# Altium schematic sheet STM32F4xx_Schematic.SchDoc
size A3; SheetNumber: 1; SheetTotal: 1
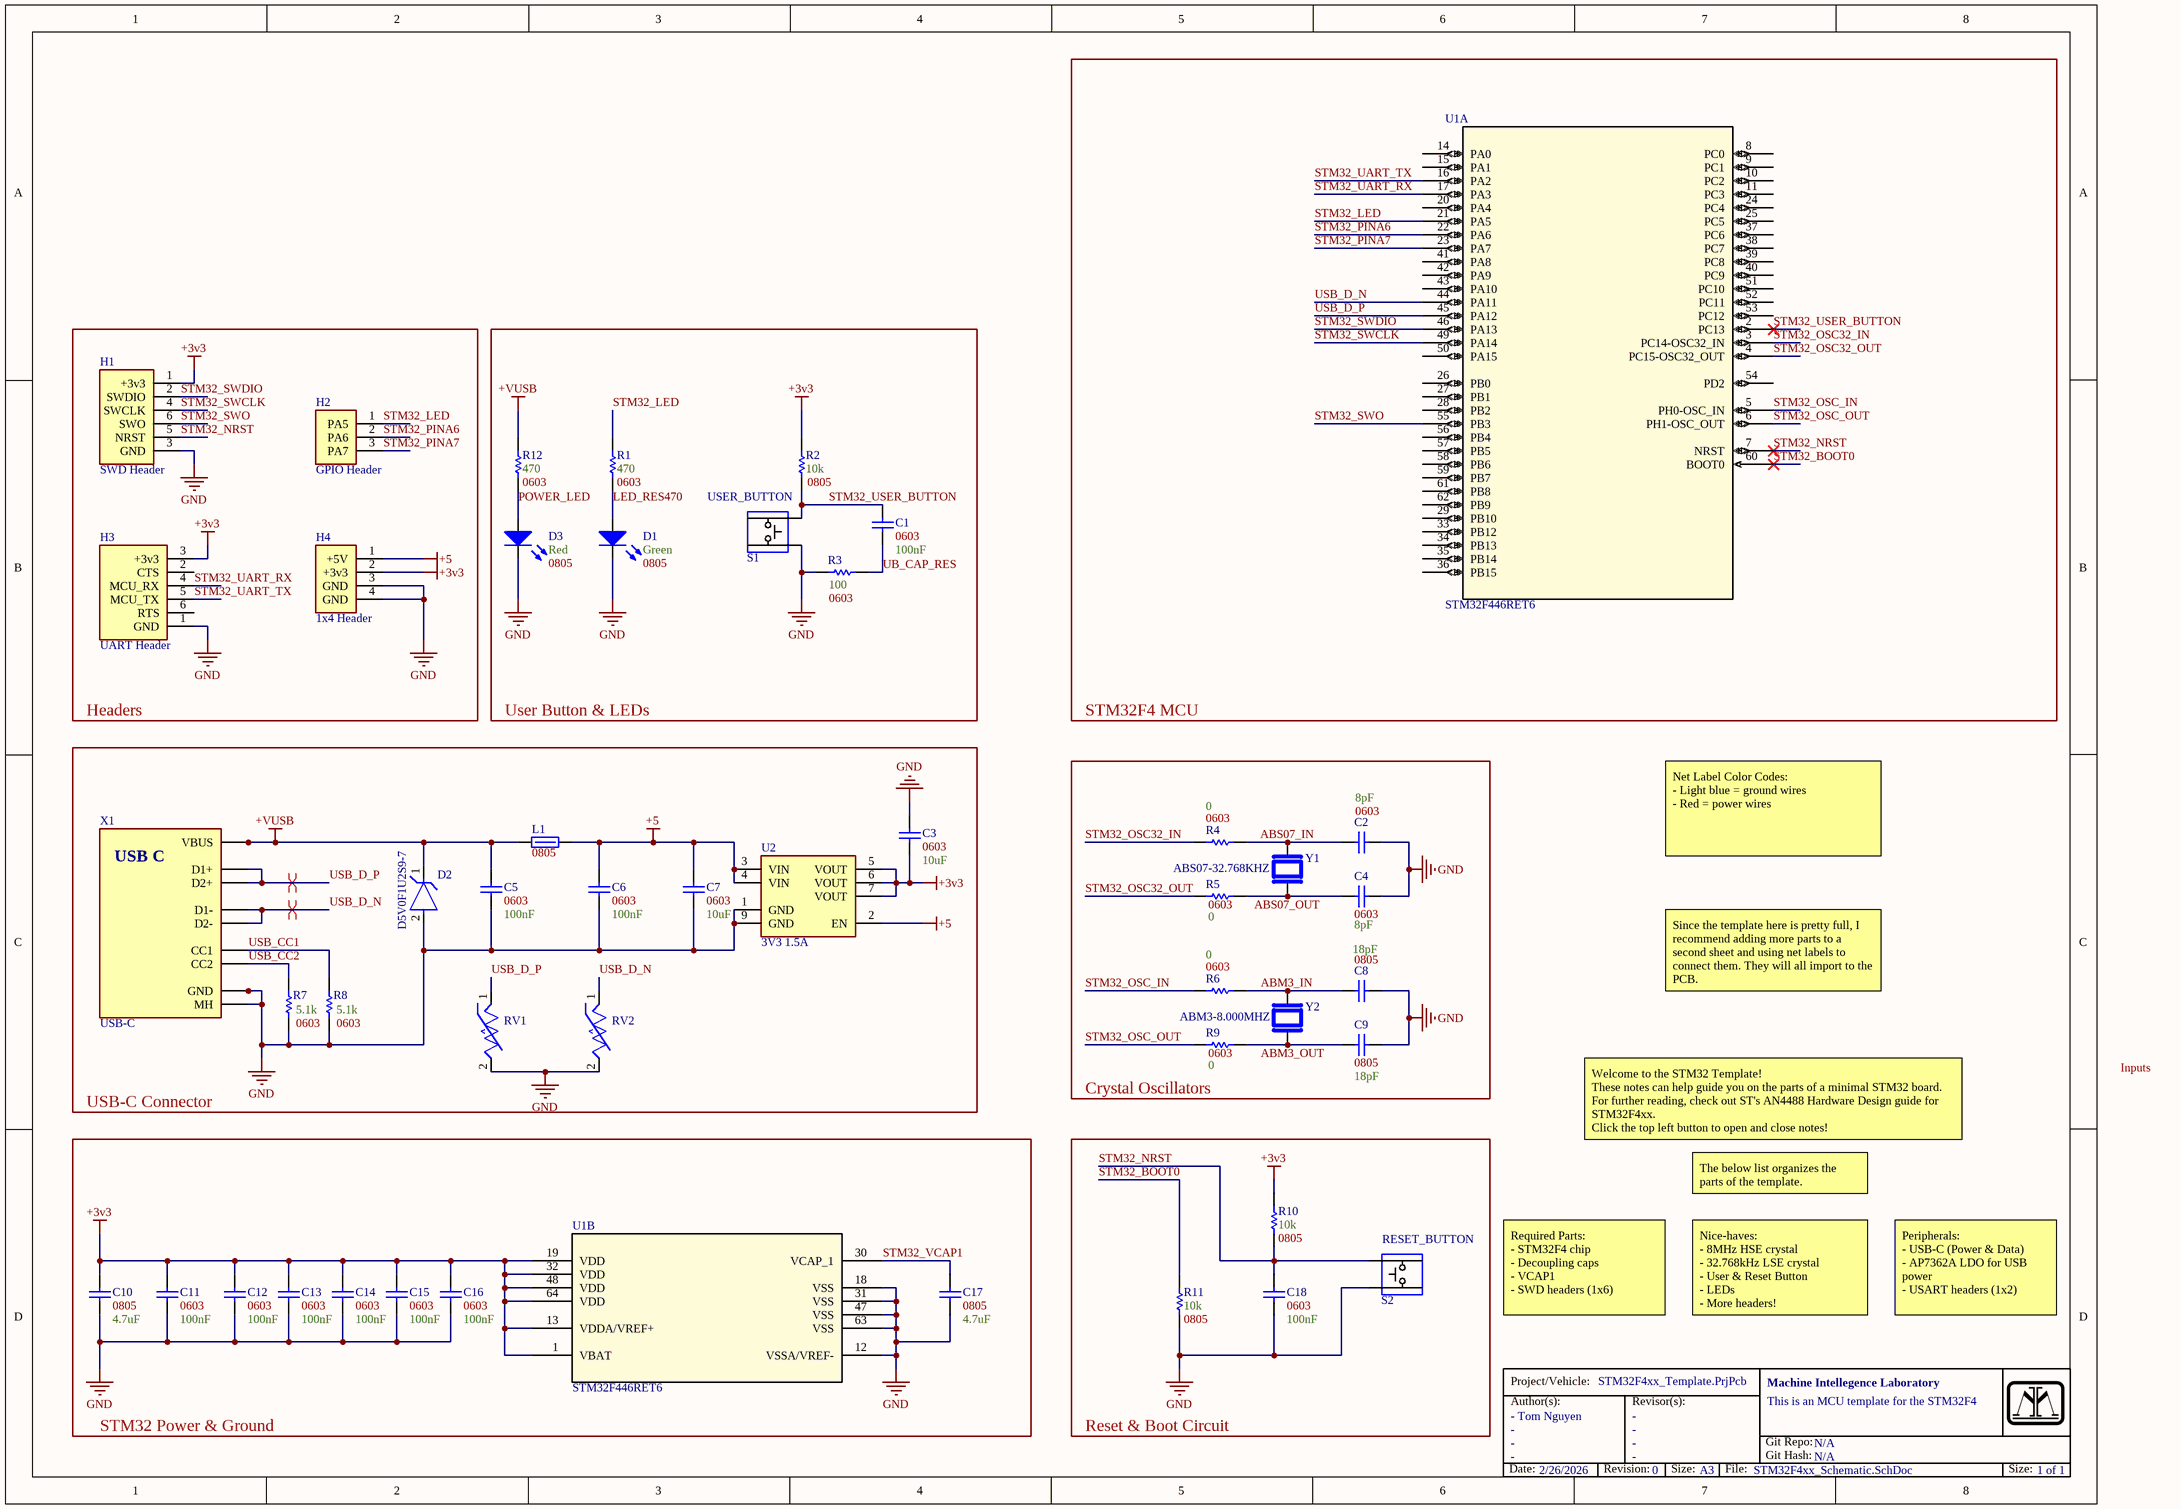
[diagram p0: STM32F4xx_Schematic.SchDoc]

## Parts
C1  Size Package: 0603  Capacitance: 100nF  [[Cap] SMD 0603]  (hidden comment: [Cap] 0603 0.1uF 10% 16V)
C2  Siz: 0603  [[Cap] 0603 8pF ±0.1pF 50V]  (hidden comment: 8pF)
C3  Size Package: 0603  Capacitance: 10uF  [[Cap] SMD 0603]  (hidden comment: [Cap] 0603 10uF 10% 10V)
C4  Siz: 0603  [[Cap] 0603 8pF ±0.1pF 50V]  (hidden comment: 8pF)
C5  Size Package: 0603  Capacitance: 100nF  [[Cap] SMD 0603]  (hidden comment: [Cap] 0603 0.1uF 10% 16V)
C6  Size Package: 0603  Capacitance: 100nF  [[Cap] SMD 0603]  (hidden comment: [Cap] 0603 0.1uF 10% 16V)
C7  Size Package: 0603  Capacitance: 10uF  [[Cap] SMD 0603]  (hidden comment: [Cap] 0603 10uF 10% 10V)
C8  Size: 0805  Capacitance: 18pF  [[Cap] 0805 ±5% 250V]  (hidden comment: [Cap] 0805 18pF ±5% 250V)
C9  Size: 0805  Capacitance: 18pF  [[Cap] 0805 ±5% 250V]  (hidden comment: [Cap] 0805 18pF ±5% 250V)
C10  Size Package: 0805  Capacitance: 4.7uF  [[Cap] SMD 0805]  (hidden comment: [Cap] 0805 4.7uF 10% 50V)
C11  Size Package: 0603  Capacitance: 100nF  [[Cap] SMD 0603]  (hidden comment: [Cap] 0603 0.1uF 10% 16V)
C12  Size Package: 0603  Capacitance: 100nF  [[Cap] SMD 0603]  (hidden comment: [Cap] 0603 0.1uF 10% 16V)
C13  Size Package: 0603  Capacitance: 100nF  [[Cap] SMD 0603]  (hidden comment: [Cap] 0603 0.1uF 10% 16V)
C14  Size Package: 0603  Capacitance: 100nF  [[Cap] SMD 0603]  (hidden comment: [Cap] 0603 0.1uF 10% 16V)
C15  Size Package: 0603  Capacitance: 100nF  [[Cap] SMD 0603]  (hidden comment: [Cap] 0603 0.1uF 10% 16V)
C16  Size Package: 0603  Capacitance: 100nF  [[Cap] SMD 0603]  (hidden comment: [Cap] 0603 0.1uF 10% 16V)
C17  Size Package: 0805  Capacitance: 4.7uF  [[Cap] SMD 0805]  (hidden comment: [Cap] 0805 4.7uF 10% 50V)
C18  Size Package: 0603  Capacitance: 100nF  [[Cap] SMD 0603]  (hidden comment: [Cap] 0603 0.1uF 10% 16V)
D1  Color: Green  Size Package: 0805  [[LED] SMD 0805]  (hidden comment: [LED] SMD 0805 Green)
D2  Cathode side marked by line  [[TVS] Unidirectional for 5V ESD]  (value not drawn)
D3  Color: Red  Size Package: 0805  [[LED] SMD 0805]  (hidden comment: [LED] SMD 0805 Red)
H1  SWD Header  [[Header] 1x6 Male STM32 SWD]
H2  GPIO Header  [[Header] 1x3 Male GPIO]
H3  UART Header  [[Header] 1x6 Male STM32 UART]
H4  1x4 Header  [[Header] 1x4 Male Power]
L1  Size Package: 0805  [[Ferrite] SMD 0805]  (hidden comment: 652-MH2029-300Y)
R1  Resistance: 470  Size Package: 0603  [RESC1608X55X25LL10T15]  (hidden comment: RC0603JR-13470RL)
R2  Resistance: 10k  Size Package: 0805  [[Res] SMD 0603]  (hidden comment: [10k] SMD 0603 1% 1/8W)
R3  Resistance: 100  Size Package: 0603  [[Res] SMD 0603]  (hidden comment: [100] SMD 0603 1% 1/10W)
R4  Resistance: 0  Size Package: 0603  [[0] SMD 0603 5% 1/10W]  (hidden comment: [0] SMD 0603 5% 1/10W)
R5  Resistance: 0  Size Package: 0603  [[0] SMD 0603 5% 1/10W]  (hidden comment: [0] SMD 0603 5% 1/10W)
R6  Resistance: 0  Size Package: 0603  [[0] SMD 0603 5% 1/10W]  (hidden comment: [0] SMD 0603 5% 1/10W)
R7  Resistance: 5.1k  Size Package: 0603  [[Res] SMD 0603]  (hidden comment: [5.1k] SMD 0603 1% 1/10W)
R8  Resistance: 5.1k  Size Package: 0603  [[Res] SMD 0603]  (hidden comment: [5.1k] SMD 0603 1% 1/10W)
R9  Resistance: 0  Size Package: 0603  [[0] SMD 0603 5% 1/10W]  (hidden comment: [0] SMD 0603 5% 1/10W)
R10  Resistance: 10k  Size Package: 0805  [[Res] SMD 0603]  (hidden comment: [10k] SMD 0603 1% 1/8W)
R11  Resistance: 10k  Size Package: 0805  [[Res] SMD 0603]  (hidden comment: [10k] SMD 0603 1% 1/8W)
R12  Resistance: 470  Size Package: 0603  [RESC1608X55X25LL10T15]  (hidden comment: RC0603JR-13470RL)
RV1  [ESD] SMD Varistor for USB 3.3V lines  [[ESD] SMD Varistor for USB 3.3V lines]  (value not drawn)
RV2  [ESD] SMD Varistor for USB 3.3V lines  [[ESD] SMD Varistor for USB 3.3V lines]  (value not drawn)
S1  Standard pushbutton  [[SPST] Pushbutton]  (value not drawn)
S2  Standard pushbutton  [[SPST] Pushbutton]  (value not drawn)
U1  STM32F446RET6  [STM32F446RET6]  (parts A,B of 2)
U2  3V3 1.5A  [[Linear] 3V3 1.5A]
X1  USB-C  [[USB] USB-C Right-Angle]
Y1  ABS07-32.768KHZ  [ABS07-32.768KHZ]
Y2  ABM3-8.000MHZ  [ABM3-8.000MHZ]

## Blocks framed on the sheet
STM32F4 MCU: U1
Headers: H1-H4
User Button & LEDs: C1 D1 D3 R1-R3 R12 S1
USB-C Connector: C3 C5-C7 D2 L1 R7 R8 RV1 RV2 U2 X1
Crystal Oscillators: C2 C4 C8 C9 R4-R6 R9 Y1 Y2
STM32 Power & Ground: C10-C17 U1
Reset & Boot Circuit: C18 R10 R11 S2

## Nets
+3v3: C3.1 C10.2 C11.2 C12.1 C13.1 C14.1 C15.1 C16.2 H1.1(+3v3) H3.3(+3v3) H4.2(+3v3) R2.1 R10.2 U1.1(VBAT) U1.13(VDDA/VREF+) U1.19(VDD) U1.32(VDD) U1.48(VDD) U1.64(VDD) U2.5(VOUT) U2.6(VOUT) U2.7(VOUT)
+5: C6.1 C7.2 H4.1(+5V) L1.2 U2.2(EN) U2.3(VIN) U2.4(VIN)
+VUSB: C5.1 D2.1 L1.1 R12.1 X1.A4(VBUS) X1.A9(VBUS) X1.B4(VBUS) X1.B9(VBUS)
GND: C2.2 C3.2 C4.2 C5.2 C6.2 C7.1 C8.2 C9.2 C10.1 C11.1 C12.2 C13.2 C14.2 C15.2 C16.1 C17.1 C18.2 D1.2(Cathode) D2.2 D3.2(Cathode) H1.3(GND) H3.1(GND) H4.3(GND) H4.4(GND) R3.1 R7.2 R8.2 R11.2 RV1.2 RV2.2 S1.1 S2.2 U1.12(VSSA/VREF-) U1.18(VSS) U1.31(VSS) U1.47(VSS) U1.63(VSS) U2.1(GND) U2.9(GND) X1.A1(GND) X1.A12(GND) X1.B1(GND) X1.B12(GND) X1.MH
ABM3_IN: C8.1 R6.2 Y2.2
ABM3_OUT: C9.1 R9.2 Y2.1
ABS07_IN: C2.1 R4.2 Y1.1
ABS07_OUT: C4.1 R5.2 Y1.2
LED_RES470: D1.1(Anode) R1.2
POWER_LED: D3.1(Anode) R12.2
STM32_BOOT0: R11.1 U1.60(BOOT0)
STM32_LED: H2.1(PA5) R1.1 U1.21(PA5)
STM32_NRST: C18.1 H1.5(NRST) R10.1 S2.1 U1.7(NRST)
STM32_OSC32_IN: R4.1 U1.3(PC14-OSC32_IN)
STM32_OSC32_OUT: R5.1 U1.4(PC15-OSC32_OUT)
STM32_OSC_IN: R6.1 U1.5(PH0-OSC_IN)
STM32_OSC_OUT: R9.1 U1.6(PH1-OSC_OUT)
STM32_PINA6: H2.2(PA6) U1.22(PA6)
STM32_PINA7: H2.3(PA7) U1.23(PA7)
STM32_SWCLK: H1.4(SWCLK) U1.49(PA14)
STM32_SWDIO: H1.2(SWDIO) U1.46(PA13)
STM32_SWO: H1.6(SWO) U1.55(PB3)
STM32_UART_RX: H3.4(MCU_RX) U1.17(PA3)
STM32_UART_TX: H3.5(MCU_TX) U1.16(PA2)
STM32_USER_BUTTON: C1.2 R2.2 S1.2 U1.2(PC13)
STM32_VCAP1: C17.2 U1.30(VCAP_1)
UB_CAP_RES: C1.1 R3.2
USB_CC1: R8.1 X1.A5(CC1)
USB_CC2: R7.1 X1.B5(CC2)
USB_D_N: RV2.1 U1.44(PA11) X1.A7(D1-) X1.B7(D2-)
USB_D_P: RV1.1 U1.45(PA12) X1.A6(D1+) X1.B6(D2+)

Not connected (* = marked no-connect by the designer): H3 2(CTS) 6(RTS); U1 8(PC0) 9(PC1) 10(PC2) 11(PC3) 14(PA0) 15(PA1) 20(PA4) 24(PC4) 25(PC5) 26(PB0) 27(PB1) 28(PB2) 29(PB10) 33(PB12) 34(PB13) 35(PB14) 36(PB15) 37(PC6) 38(PC7) 39(PC8) 40(PC9) 41(PA8) 42(PA9) 43(PA10) 50(PA15) 51(PC10) 52(PC11) 53(PC12) 54(PD2) 56(PB4) 57(PB5) 58(PB6) 59(PB7) 61(PB8) 62(PB9)

## Layout directives
differential pair; differential pair class DIFF_USB: USB_D_N, USB_D_P

## Notes on the sheet
- USER_BUTTON
- (near U1) Generic ERC is due to buttons needing driving pin when MCU pins are currently GPIO passives.
- (near H4) You can view and customize STM32 MCU pinouts by using the STM32CubeMX application.
- The STM32 pin LED is active-high and the button is active-low.
- Net Label Color Codes:
  - Light blue = ground wires
  - Red = power wires
- This is the Low-Speed External (LSE) clock!
  It is useful for stable, real-time clocks
  I referenced the AN2867 to determine clock and cap values. Replace resistors as neccessary.
- The TVS diode serves as protection from ESD (electro-static discharge).
  When voltage goes above the diode's breakdown of 5.5V, the connection goes to ground and prevents overflow to the main board.
- (near C6) This is a π-filter, and it is used as a low-pass to get a clean 5V from the USB-C.
- (near U2) The AP7362 LDO converts from 5V to 3.3V.
- Since the template here is pretty full, I recommend adding more parts to a second sheet and using net labels to connect them. They will all import to the PCB.
- (near RV2) These varistors serve as protection from ESD.
- This is the High-Speed External (HSE) clock!
  It is useful for stable high speeds (such as UART or USB)
  I referenced the AN2867 to determine clock and cap values. Replace resistors as neccessary.
- Inputs
- USB-C requires 5.1k resistors for CC lines to request +5V for the board.
  It also has D1 and D2 differential pair lines. The D1 and D2 are the reason why USB-C can be inserted either way!
- Welcome to the STM32 Template!
  These notes can help guide you on the parts of a minimal STM32 board.
  For further reading, check out ST's AN4488 Hardware Design guide for STM32F4xx.
  Click the top left button to open and close notes!
- The below list organizes the parts of the template.
- (near R10) This light pull-up supports the internal pull-up for NRST! It is helpful as NRST is an active low reset, so this keeps the line high when we're not resetting.
- (near S2) RESET_BUTTON
- (near R11) For the STM32F4 series, when there is one VCAP, it must have a 4.7 uF cap to ground. It must also be low ESR. (Refer to AN4488)
- Required Parts:
  - STM32F4 chip
  - Decoupling caps
  - VCAP1
  - SWD headers (1x6)
- Nice-haves:
  - 8MHz HSE crystal
  - 32.768kHz LSE crystal
  - User & Reset Button
  - LEDs
  - More headers!
- Peripherals:
  - USB-C (Power & Data)
  - AP7362A LDO for USB power
  - USART headers (1x2)
- (near S2) Notice how at steady state, there is no connection to ground as the capacitor is an open circuit at steady state and the push button isn't pushed (so open circuit).
- Project/Vehicle:
- STM32F4xx_Template.PrjPcb
- Machine Intellegence Laboratory
- Since there are six power pins, we have six decoupling caps + one bulk cap
- (near U1) For more sensitive applications,
  it is recommended to filter the +3v3 for VSSA/VREF+ seperately
- Author(s):
- - Tom Nguyen
- -
- Revisor(s):
- Git Repo:
- Git Hash:
- This is an MCU template for the STM32F4
- N/A
- Date:
- 2/26/2026
- Revision:
- 0
- Size:
- A3
- File:
- STM32F4xx_Schematic.SchDoc
- 1 of 1
- (in symbol [USB] Type-C Right-Angle) USB C

## Library data of the parts
C1 C5 C6 C11-C16 C18 = [Cap] 0603 0.1uF 10% 16V: CC0603KRX7R7BB104; Supplier 1: DigiKey; Supplier Part Number 1: 311-1088-6-ND; Max Voltage: 16V; Tolerance: 10%
C2 C4 = [Cap] 0603 8pF ±0.1pF 50V: GRM1555C1H8R0BA01D; Manufacturer_Name: Murata; Copyright: Copyright (C) 2026 Ultra Librarian. All rights reserved.; Manufacturer_Part_Number: GRM1555C1H8R0BA01D; Digi-Key_Part_Number_1: 490-8230-1-ND; Digi-Key_Part_Number_2: 490-8230-2-ND; Digi-Key_Part_Number_3: 490-8230-6-ND; Supplier 1: Arrow Electronics; Capacitance: 8pF
C3 C7 = [Cap] 0603 10uF 10% 10V: CL10A106KP8NNNC; Supplier 1: DigiKey; Supplier Part Number 1: 1276-1192-6-ND; Max Voltage: 10V; Tolerance: 10%
C8 C9 = [Cap] 0805 18pF ±5% 250V: GQM2195C2E180JB12D; MF: Murata; MP: GQM2195C2E270JB12D; SnapEDA_Link: https://www.snapeda.com/parts/GQM2195C2E270JB12D/Murata/view-part/?ref=snap; Package: 2012 Murata; Check_prices: https://www.snapeda.com/parts/GQM2195C2E270JB12D/Murata/view-part/?ref=eda; Supplier 1: Arrow Electronics
C10 C17 = [Cap] 0805 4.7uF 10% 50V: GRT21BR61H475KE13L; Supplier 1: DigiKey; Supplier Part Number 1: 490-12394-1-ND; Max Voltage: 50V; Tolerance: 10%
D1 = [LED] SMD 0805 Green: LG R971-KN-1-0-20-R18; Supplier 1: DigiKey; Supplier Part Number 1: 475-LGR971-KN-1CT-ND
D2 = [TVS] Unidirectional for 5V ESD: D5V0F1U2S9-7; Manufacturer_Name: Diodes Inc; Reverse Breakdown Voltage: 5.5V; Copyright: Copyright (C) 2025 Ultra Librarian. All rights reserved.; Manufacturer_Part_Number: D5V0F1U2S9-7; Supplier 1: Avnet; Size Package: 0603; Supplier Part Number 1: D5V0F1U2S9-7
D3 = [LED] SMD 0805 Red: LS R976-NR-1-0-20-R18; Supplier 1: DigiKey; Supplier Part Number 1: 475-LSR976-NR-1CT-ND
H1 = [Header] 1x6 Male STM32 SWD: 2.54mm pitch
H2 = [Header] 1x3 Male GPIO: 2.54mm pitch
H3 = [Header] 1x6 Male STM32 UART: 2.54mm pitch
H4 = [Header] 1x4 Male Power: 2.54mm pitch
L1 = [Ferrite] SMD 0805 3A 30ohm: Res @ Freq: 30 @ 100MHz; Supplier 1: DigiKey; Supplier Part Number 1: MH2029-300YCT-ND
R1 R12 = CMP-2000-04326-1: Manufacturer: Yageo; Part Number: RC0603JR-13470RL
R2 R10 R11 = [10k] SMD 0603 1% 1/8W: RC0805JR-0710KL; Tolerance: 5%; Supplier 1: DigiKey; Supplier Part Number 1: 311-10KARCT-ND; Wattage: 1/8W
R3 = [100] SMD 0603 1% 1/10W: RC0603FR-07100RL; Supplier 1: DigiKey; Supplier Part Number 1: 311-100HRDKR-ND; Wattage: 1/10W; Tolerance: 1%
R4-R6 R9 = [0] SMD 0603 5% 1/10W: RC0603JR-070RL; MF: Yageo; SnapEDA_Link: https://www.snapeda.com/parts/RC0603JR-070RL/Yageo/view-part/?ref=snap; Package: 0603 Yageo; Value: *; MP: RC0603JR-070RL; Check_prices: https://www.snapeda.com/parts/RC0603JR-070RL/Yageo/view-part/?ref=eda; Supplier 1: Avnet; Supplier Part Number 1: RC0603JR-070RL; Tolerance: 5%; Wattage: 1/10W
R7 R8 = [5.1k] SMD 0603 1% 1/10W: RC0603FR-075K1L; Supplier 1: DigiKey; Supplier Part Number 1: 311-5.10KHRCT-ND; Wattage: 1/10W; Tolerance: 1%
RV1 RV2 = [ESD] SMD Varistor for USB 3.3V lines: Varistor 1 Circuit Surface Mount, MLCV 0603 (1608 Metric) CG0603MLU-05E; MF: Bourns; SnapEDA_Link: https://www.snapeda.com/parts/CG0603MLU-05E/Bourns/view-part/?ref=snap; Package: 0603 Bourns; Value: *; MP: CG0603MLU-05E; Check_prices: https://www.snapeda.com/parts/CG0603MLU-05E/Bourns/view-part/?ref=eda; Supplier 1: Avnet
S1 S2 = [SPST] Pushbutton: Supplier 1: DigiKey; Supplier Part Number 1: 450-1650-ND
U1 = STM32F446RET6: High-performance foundation line, Arm Cortex-M4 core with DSP and FPU, 512 Kbytes of Flash memory, 180 MHz CPU, ART Accelerator, Dual QSPI; Manufacturer_Name: STMicroelectronics; Copyright: Copyright (C) 2025 Ultra Librarian. All rights reserved.; Manufacturer_Part_Number: STM32F446RET6; RefDes: RefDes; Type: Type; Supplier 1: Avnet; Supplier Part Number 1: 52Y1122
U2 = [Linear] 3V3 1.5A: AP7362A-33SP-13; Supplier 1: DigiKey; Supplier Part Number 1: AP7362A-33SP-13DICT-ND
X1 = [USB] Type-C Right-Angle: Supplier 1: DigiKey; Supplier Part Number 1: 670-3104-1-ND
Y1 = ABS07-32.768KHZ: ABS07-32.768KHZ-9-T, 32.768 kHz Â±20ppm Crystal 9pF 70 kOhms 2-SMD, No Lead; MF: Abracon; SnapEDA_Link: https://www.snapeda.com/parts/ABS07-32.768KHZ-9-T/Abracon/view-part/?ref=snap; Package: SMD-2 Abracon LLC; Value: *; MP: ABS07-32.768KHZ-9-T; Check_prices: https://www.snapeda.com/parts/ABS07-32.768KHZ-9-T/Abracon/view-part/?ref=eda; Supplier 1: Arrow Electronics; Supplier Part Number 1: ABS07-32.768KHZ-T
Y2 = ABM3-8.000MHZ: ABM3-8.000MHZ-D2Y-T, 8 MHz Â±20ppm Crystal 18pF 140 Ohms 2-SMD, No Lead; MF: Abracon; Purchase-URL: https://pricing.snapeda.com/search/part/ABM3-8.000MHZ-D2Y-T/?ref=eda; MP: ABM3-8.000MHZ-D2Y-T; SnapEDA_Link: https://www.snapeda.com/parts/ABM3-8.000MHZ-D2Y-T/Abracon+LLC/view-part/?ref=snap; Value: *; Package: SMD-2 Abracon; Price: None; Availability: In Stock; Check_prices: https://www.snapeda.com/parts/ABM3-8.000MHZ-D2Y-T/Abracon+LLC/view-part/?ref=eda; Supplier 1: Arrow Electronics; Supplier Part Number 1: ABM3-8.000MHZ-D2Y-T